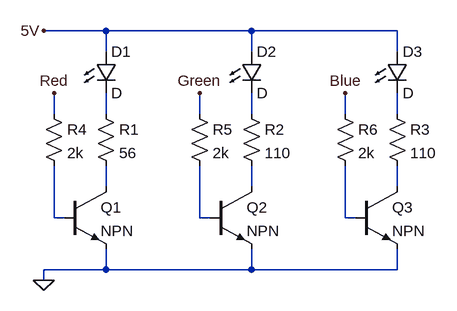
[diagram p0: schematic RGBled.asc]
RGBled.asc, the LTspice schematic file:
Version 4
SHEET 1 1668 936
WIRE 256 64 160 64
WIRE 480 64 256 64
WIRE 704 64 480 64
WIRE 256 96 256 64
WIRE 480 96 480 64
WIRE 704 96 704 64
WIRE 176 192 176 160
WIRE 256 192 256 160
WIRE 400 192 400 160
WIRE 480 192 480 160
WIRE 624 192 624 160
WIRE 704 192 704 160
WIRE 256 304 256 272
WIRE 480 304 480 272
WIRE 704 304 704 272
WIRE 176 352 176 272
WIRE 192 352 176 352
WIRE 400 352 400 272
WIRE 416 352 400 352
WIRE 624 352 624 272
WIRE 640 352 624 352
WIRE 256 432 256 400
WIRE 256 432 160 432
WIRE 480 432 480 400
WIRE 480 432 256 432
WIRE 704 432 704 400
WIRE 704 432 480 432
WIRE 160 448 160 432
FLAG 176 160 Red
FLAG 400 160 Green
FLAG 624 160 Blue
FLAG 160 64 5V
FLAG 160 448 0
SYMBOL npn 192 304 R0
SYMATTR InstName Q1
SYMBOL npn 416 304 R0
SYMATTR InstName Q2
SYMBOL npn 640 304 R0
SYMATTR InstName Q3
SYMBOL LED 240 96 R0
SYMATTR InstName D1
SYMBOL LED 464 96 R0
SYMATTR InstName D2
SYMBOL LED 688 96 R0
SYMATTR InstName D3
SYMBOL res 240 176 R0
SYMATTR InstName R1
SYMATTR Value 56
SYMBOL res 464 176 R0
SYMATTR InstName R2
SYMATTR Value 110
SYMBOL res 688 176 R0
SYMATTR InstName R3
SYMATTR Value 110
SYMBOL res 160 176 R0
SYMATTR InstName R4
SYMATTR Value 2k
SYMBOL res 384 176 R0
SYMATTR InstName R5
SYMATTR Value 2k
SYMBOL res 608 176 R0
SYMATTR InstName R6
SYMATTR Value 2k

The netlist it stands for:
* RGBled.asc
Q1 N004 N007 0 0 NPN
Q2 N005 N008 0 0 NPN
Q3 N006 N009 0 0 NPN
D1 5V N001 D
D2 5V N002 D
D3 5V N003 D
R1 N001 N004 56
R2 N002 N005 110
R3 N003 N006 110
R4 Red N007 2k
R5 Green N008 2k
R6 Blue N009 2k
.model D D
.lib standard.dio
.model NPN NPN
.model PNP PNP
.lib standard.bjt
.backanno
.end